# EAGLE design Nanocopter_alt (EAGLE 5.07)
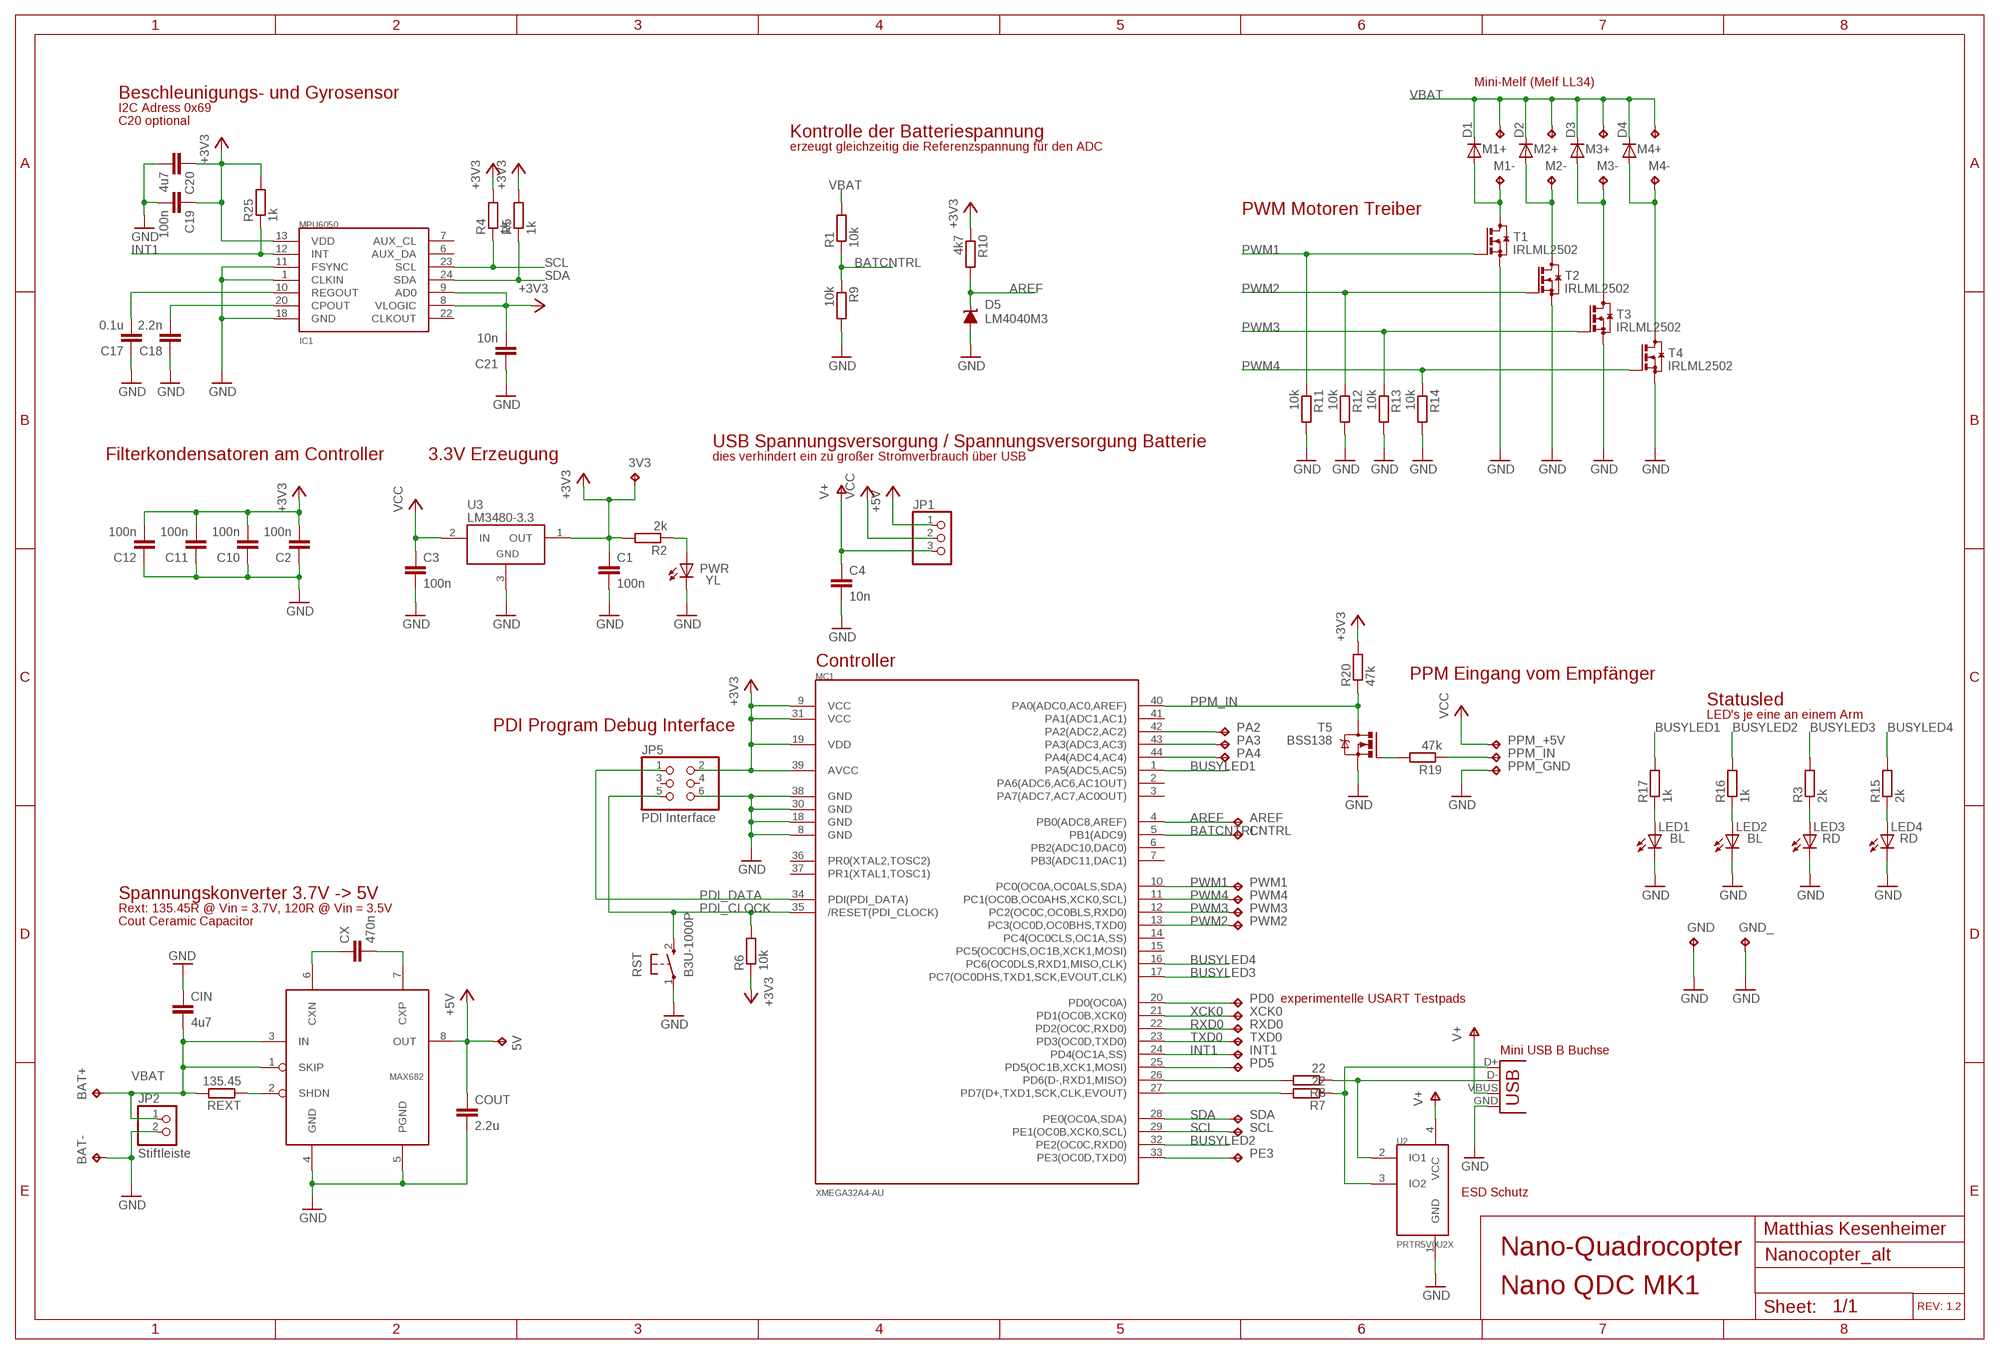
[diagram p0: schematic, sheet 1]

## Parts
3V3  TPTP12SQ  [TP12SQ]
5V  TPTP12SQ  [TP12SQ]
AREF  TPTP10SQ  [TP10SQ]
BAT+  TPTP12SQ  [TP12SQ]
BAT-  TPTP12SQ  [TP12SQ]
C1  100n  C-EUC0603  [C0603]
C2  100n  C-EUC0603  [C0603]
C3  100n  C-EUC0603  [C0603]
C4  10n  C-EUC0603  [C0603]
C10  100n  C-EUC0603  [C0603]
C11  100n  C-EUC0603  [C0603]
C12  100n  C-EUC0603  [C0603]
C17  0.1u  C-EUC0603  [C0603]
C18  2.2n  C-EUC0603  [C0603]
C19  100n  C-EUC0603  [C0603]
C20  4u7  C-EUC0603  [C0603]
C21  10n  C-EUC0603  [C0603]
CIN  4u7  C-EUC1206  [C1206]
CNTRL  TPTP10SQ  [TP10SQ]
COUT  2.2u  C-EUC1206  [C1206]
CX  470n  C-EUC0603  [C0603]
D1  DIODE-MINIMELF  [MINIMELF]
D2  DIODE-MINIMELF  [MINIMELF]
D3  DIODE-MINIMELF  [MINIMELF]
D4  DIODE-MINIMELF  [MINIMELF]
D5  LM4040M3  [SOT-23]
GND  TPTP12SQ  [TP12SQ]
GND_  TPTP12SQ  [TP12SQ]
IC1  MPU6050  [QFN-24]
INT1  TPTP10SQ  [TP10SQ]
JP1  PINHD-1X3  [1X03]
JP2  Stiftleiste  PINHD-1X2  [1X02]
JP5  PDI Interface  PINHD-2X3  [2X03]
LED1  BL  LEDCHIPLED_0603  [CHIPLED_0603]
LED2  BL  LEDCHIPLED_0603  [CHIPLED_0603]
LED3  RD  LEDCHIPLED_0603  [CHIPLED_0603]
LED4  RD  LEDCHIPLED_0603  [CHIPLED_0603]
M1+  TPTP15SQ  [TP15SQ]
M1-  TPTP15SQ  [TP15SQ]
M2+  TPTP15SQ  [TP15SQ]
M2-  TPTP15SQ  [TP15SQ]
M3+  TPTP15SQ  [TP15SQ]
M3-  TPTP15SQ  [TP15SQ]
M4+  TPTP15SQ  [TP15SQ]
M4-  TPTP15SQ  [TP15SQ]
MC1  XMEGA32A4-AU  [TQFP44]
PA2  TPTP10SQ  [TP10SQ]
PA3  TPTP10SQ  [TP10SQ]
PA4  TPTP10SQ  [TP10SQ]
PD0  TPTP10SQ  [TP10SQ]
PD5  TPTP10SQ  [TP10SQ]
PE3  TPTP10SQ  [TP10SQ]
PPM_+5V  TPTP10SQ  [TP10SQ]
PPM_GND  TPTP10SQ  [TP10SQ]
PPM_IN  TPTP10SQ  [TP10SQ]
PWM1  TPTP10SQ  [TP10SQ]
PWM2  TPTP10SQ  [TP10SQ]
PWM3  TPTP10SQ  [TP10SQ]
PWM4  TPTP10SQ  [TP10SQ]
PWR  YL  LEDCHIPLED_0603  [CHIPLED_0603]
R1  10k  R-EU_R0603  [R0603]
R2  2k  R-EU_R0603  [R0603]
R3  2k  R-EU_R0603  [R0603]
R4  1k  R-EU_R0603  [R0603]
R5  1k  R-EU_R0603  [R0603]
R6  10k  R-EU_R0603  [R0603]
R7  22  R-EU_R0603  [R0603]
R8  22  R-EU_R0603  [R0603]
R9  10k  R-EU_R0603  [R0603]
R10  4k7  R-EU_R0603  [R0603]
R11  10k  R-EU_R0603  [R0603]
R12  10k  R-EU_R0603  [R0603]
R13  10k  R-EU_R0603  [R0603]
R14  10k  R-EU_R0603  [R0603]
R15  2k  R-EU_R0603  [R0603]
R16  1k  R-EU_R0603  [R0603]
R17  1k  R-EU_R0603  [R0603]
R19  47k  R-EU_R0603  [R0603]
R20  47k  R-EU_R0603  [R0603]
R25  1k  R-EU_R0603  [R0603]
REXT  135.45  R-EU_R0603  [R0603]
RST  B3U-1000P  [SW_SMD]
RXD0  TPTP10SQ  [TP10SQ]
SCL  TPTP10SQ  [TP10SQ]
SDA  TPTP10SQ  [TP10SQ]
T1  IRLML2502  BSS123  [SOT23]
T2  IRLML2502  BSS123  [SOT23]
T3  IRLML2502  BSS123  [SOT23]
T4  IRLML2502  BSS123  [SOT23]
T5  BSS138  [SOT23]
TXD0  TPTP10SQ  [TP10SQ]
U1  MAX682  [SOIC(N)8]
U2  PRTR5V0U2X  [SOT143B]
U3  LM3480-3.3  [SOT-23-3]
X1  USBSMD  [USB-MINIB]
XCK0  TPTP10SQ  [TP10SQ]

## Nets
+3V3: 3V3.TP C1.1 C2.2 C10.2 C11.2 C12.2 C19.1 C20.1 C21.2 IC1.8(VLOGIC) IC1.9(AD0) IC1.13(VDD) JP5.2 MC1.9(VCC) MC1.19(VDD) MC1.31(VCC) MC1.39(AVCC) R2.2 R4.2 R5.2 R6.1 R10.1 R20.2 R25.2 U3.1(OUT)
+5V: 5V.TP COUT.1 JP1.1 U1.8(OUT)
AREF: AREF.TP D5.1(C) MC1.4(PB0(ADC8,AREF)) R10.2
BATCNTRL: CNTRL.TP MC1.5(PB1(ADC9)) R1.1 R9.1
BUSYLED1: MC1.1(PA5(ADC5,AC5)) R17.2
BUSYLED2: MC1.32(PE2(OC0C,RXD0)) R16.2
BUSYLED3: MC1.17(PC7(OC0DHS,TXD1,SCK,EVOUT,CLK)) R3.2
BUSYLED4: MC1.16(PC6(OC0DLS,RXD1,MISO,CLK)) R15.2
D+: MC1.27(PD7(D+,TXD1,SCK,CLK,EVOUT)) R7.2
D-: MC1.26(PD6(D-,RXD1,MISO)) R8.2
GND: BAT-.TP C1.2 C2.1 C3.2 C4.2 C10.1 C11.1 C12.1 C17.1 C18.1 C19.2 C20.2 C21.1 CIN.1 COUT.2 D5.2(A) GND.TP GND_.TP IC1.1(CLKIN) IC1.11(FSYNC) IC1.18(GND) JP2.2 JP5.6 LED1.C LED2.C LED3.C LED4.C MC1.8(GND) MC1.18(GND) MC1.30(GND) MC1.38(GND) PPM_GND.TP PWR.C R9.2 R11.2 R12.2 R13.2 R14.2 RST.1 T1.2(S) T2.2(S) T3.2(S) T4.2(S) T5.2(S) U1.4(GND) U1.5(PGND) U2.1(GND) U3.3(GND) X1.GND
INT1: IC1.12(INT) INT1.TP MC1.24(PD4(OC1A,SS)) R25.1
N$2: R19.2 T5.1(G)
N$3: PPM_IN.TP R19.1
N$4: MC1.44(PA4(ADC4,AC4)) PA4.TP
N$6: CX.1 U1.6(CXN)
N$7: MC1.43(PA3(ADC3,AC3)) PA3.TP
N$8: MC1.42(PA2(ADC2,AC2)) PA2.TP
N$9: PWR.A R2.1
N$10: LED3.A R3.1
N$11: REXT.1 U1.2(SHDN)
N$13: CX.2 U1.7(CXP)
N$15: LED4.A R15.1
N$17: LED2.A R16.1
N$18: LED1.A R17.1
N$19: D1.A M1-.TP T1.3(D)
N$21: D3.A M3-.TP T3.3(D)
N$22: D4.A M4-.TP T4.3(D)
N$26: C17.2 IC1.10(REGOUT)
N$27: C18.2 IC1.20(CPOUT)
N$30: D2.A M2-.TP T2.3(D)
N$35: MC1.20(PD0(OC0A)) PD0.TP
N$36: MC1.25(PD5(OC1B,XCK1,MOSI)) PD5.TP
N$38: MC1.33(PE3(OC0D,TXD0)) PE3.TP
PDI_CLOCK: JP5.5 MC1.35(/RESET(PDI_CLOCK)) R6.2 RST.2
PDI_DATA: JP5.1 MC1.34(PDI(PDI_DATA))
PPM_IN: MC1.40(PA0(ADC0,AC0,AREF)) R20.1 T5.3(D)
PWM1: MC1.10(PC0(OC0A,OC0ALS,SDA)) PWM1.TP R11.1 T1.1(G)
PWM2: MC1.13(PC3(OC0D,OC0BHS,TXD0)) PWM2.TP R12.1 T2.1(G)
PWM3: MC1.12(PC2(OC0C,OC0BLS,RXD0)) PWM3.TP R13.1 T3.1(G)
PWM4: MC1.11(PC1(OC0B,OC0AHS,XCK0,SCL)) PWM4.TP R14.1 T4.1(G)
RXD0: MC1.22(PD2(OC0C,RXD0)) RXD0.TP
SCL: IC1.23(SCL) MC1.29(PE1(OC0B,XCK0,SCL)) R4.1 SCL.TP
SDA: IC1.24(SDA) MC1.28(PE0(OC0A,SDA)) R5.1 SDA.TP
TXD0: MC1.23(PD3(OC0D,TXD0)) TXD0.TP
USB+: R7.1 U2.3(IO2) X1.D+
USB-: R8.1 U2.2(IO1) X1.D-
V+: C4.1 JP1.3 U2.4(VCC) X1.VBUS
VBAT: BAT+.TP CIN.2 D1.C D2.C D3.C D4.C JP2.1 M1+.TP M2+.TP M3+.TP M4+.TP R1.2 REXT.2 U1.1(SKIP) U1.3(IN)
VCC: C3.1 JP1.2 PPM_+5V.TP U3.2(IN)
XCK0: MC1.21(PD1(OC0B,XCK0)) XCK0.TP
Unconnected: IC1.6(AUX_DA) IC1.7(AUX_CL) IC1.22(CLKOUT) JP5.3 JP5.4 MC1.2(PA6(ADC6,AC6,AC1OUT)) MC1.3(PA7(ADC7,AC7,AC0OUT)) MC1.6(PB2(ADC10,DAC0)) MC1.7(PB3(ADC11,DAC1)) MC1.14(PC4(OC0CLS,OC1A,SS)) MC1.15(PC5(OC0CHS,OC1B,XCK1,MOSI)) MC1.36(PR0(XTAL2,TOSC2)) MC1.37(PR1(XTAL1,TOSC1)) MC1.41(PA1(ADC1,AC1))

## Notes on the sheet
- Mini-Melf (Melf LL34)
- Beschleunigungs- und Gyrosensor
- I2C Adress 0x69
- C20 optional
- Kontrolle der Batteriespannung
- erzeugt gleichzeitig die Referenzspannung für den ADC
- PWM Motoren Treiber
- USB Spannungsversorgung / Spannungsversorgung Batterie
- Filterkondensatoren am Controller | 3.3V Erzeugung | dies verhindert ein zu großer Stromverbrauch über USB
- Controller
- PPM Eingang vom Empfänger
- Statusled
- LED's je eine an einem Arm
- PDI Program Debug Interface
- Spannungskonverter 3.7V -> 5V
- Rext: 135.45R @ Vin = 3.7V, 120R @ Vin = 3.5V
- Cout Ceramic Capacitor
- experimentelle USART Testpads
- Mini USB B Buchse
- ESD Schutz
- Matthias Kesenheimer
- Nano-Quadrocopter
- Nano QDC MK1
- REV: 1.2

## Library data of the parts
3V3 5V AREF BAT+ BAT- CNTRL GND GND_ INT1 M1+ M1- M2+ M2- M3+ M3- M4+ M4- PA2-PA4 PD0 PD5 PE3 PPM_+5V PPM_GND PPM_IN PWM1-PWM4 RXD0 SCL SDA TXD0 XCK0 = testpad:TP: Test pad
C1-C4 C10-C12 C17-C21 CIN COUT CX = rcl:C-EU: CAPACITOR, European symbol
D1-D4 = diode:DIODE-: DIODE
D5 = texas:LM4040M3
IC1 = SparkFun:MPU6050
JP1 = pinhead:PINHD-1X3: PIN HEADER
JP2 = pinhead:PINHD-1X2: PIN HEADER
JP5 = pinhead:PINHD-2X3: PIN HEADER
LED1-LED4 PWR = led:LED: LED OSRAM: - CHIPLED LG R971, LG N971, LY N971, LG Q971, LY Q971, LO R971, LY R971 LH N974, LH R974 LS Q976, LO Q976, LY Q976 LO Q996 - Hyper CHIPLED LW Q18S LB Q993, LB Q99A, LB R99A - SideLED LS A670, LO A670, LY A670, LG A670, LP A670 LB A673, LV A673, LT A673, LW A673 LH A674 LY A675 LS A676, LA A676, LO A676, LY A676, LW A676 LS A679, LY A679, LG A679 - Hyper Micro SIDELED® LS Y876, LA Y876, LO Y876, LY Y876 LT Y87S - SmartLED LW L88C, LW L88S LB L89C, LB L89S, LG L890 LS L89K, LO L89K, LY L89K LS L896, LA L896, LO L896, LY L896 - TOPLED LS T670, LO T670, LY T670, LG T670, LP T670 LSG T670, LSP T670, LSY T670, LOP T670, LYG T670 LG T671, LOG T671, LSG T671 LB T673, LV T673, LT T673, LW T673 LH T674 LS T676, LA T676, LO T676, LY T676, LB T676, LH T676, LSB T676, LW T676 LB T67C, LV T67C, LT T67C, LS T67K, LO T67K, LY T67K, LW E67C LS E67B, LA E67B, LO E67B, LY E67B, LB E67C, LV E67C, LT E67C LW T67C LS T679, LY T679, LG T679 LS T770, LO T770, LY T770, LG T770, LP T770 LB T773, LV T773, LT T773, LW T773 LH T774 LS E675, LA E675, LY E675, LS T675 LS T776, LA T776, LO T776, LY T776, LB T776 LHGB T686 LT T68C, LB T68C - Hyper Mini TOPLED® LB M676 - Mini TOPLED Santana® LG M470 LS M47K, LO M47K, LY M47K Source: http://www.osram.convergy.de LUXEON: - LUMILED® LXK2-PW12-R00, LXK2-PW12-S00, LXK2-PW14-U00, LXK2-PW14-V00 LXK2-PM12-R00, LXK2-PM12-S00, LXK2-PM14-U00 LXK2-PE12-Q00, LXK2-PE12-R00, LXK2-PE12-S00, LXK2-PE14-T00, LXK2-PE14-U00 LXK2-PB12-K00, LXK2-PB12-L00, LXK2-PB12-M00, LXK2-PB14-N00, LXK2-PB14-P00, LXK2-PB14-Q00 LXK2-PR12-L00, LXK2-PR12-M00, LXK2-PR14-Q00, LXK2-PR14-R00 LXK2-PD12-Q00, LXK2-PD12-R00, LXK2-PD12-S00 LXK2-PH12-R00, LXK2-PH12-S00 LXK2-PL12-P00, LXK2-PL12-Q00, LXK2-PL12-R00 Source: www.luxeon.com KINGBRIGHT: KA-3528ASYC Source: www.kingbright.com
MC1 = atmel:XMEGA32A4-AU
R1-R17 R19 R20 R25 REXT = rcl:R-EU_: RESISTOR, European symbol
RST = Omron:B3U-1000P
T1-T4 = transistor-small-signal:BSS123: N-CHANNEL MOS FET
T5 = mylib:BSS138
U1 = maxim:MAX682
U2 = Philips:PRTR5V0U2X
U3 = regulators:LM3480-*: National Semiconductor LM3480 100 mA, SOT-23, quasi-LDO linear regulator
X1 = SparkFun:USB: USB Connectors USB-B-PTH is fully proven SKU : PRT-00139 USB-miniB is fully proven SKU : PRT-00587 USB-A-PCB is untested. USB-A-H is throughly reviewed, but untested. Spark Fun Electronics SKU : PRT-00437 USB-B-SMT is throughly reviewed, but untested. Needs silkscreen touching up. USB-A-S has not been used/tested USB-MB-H has not been used/tested

## Board
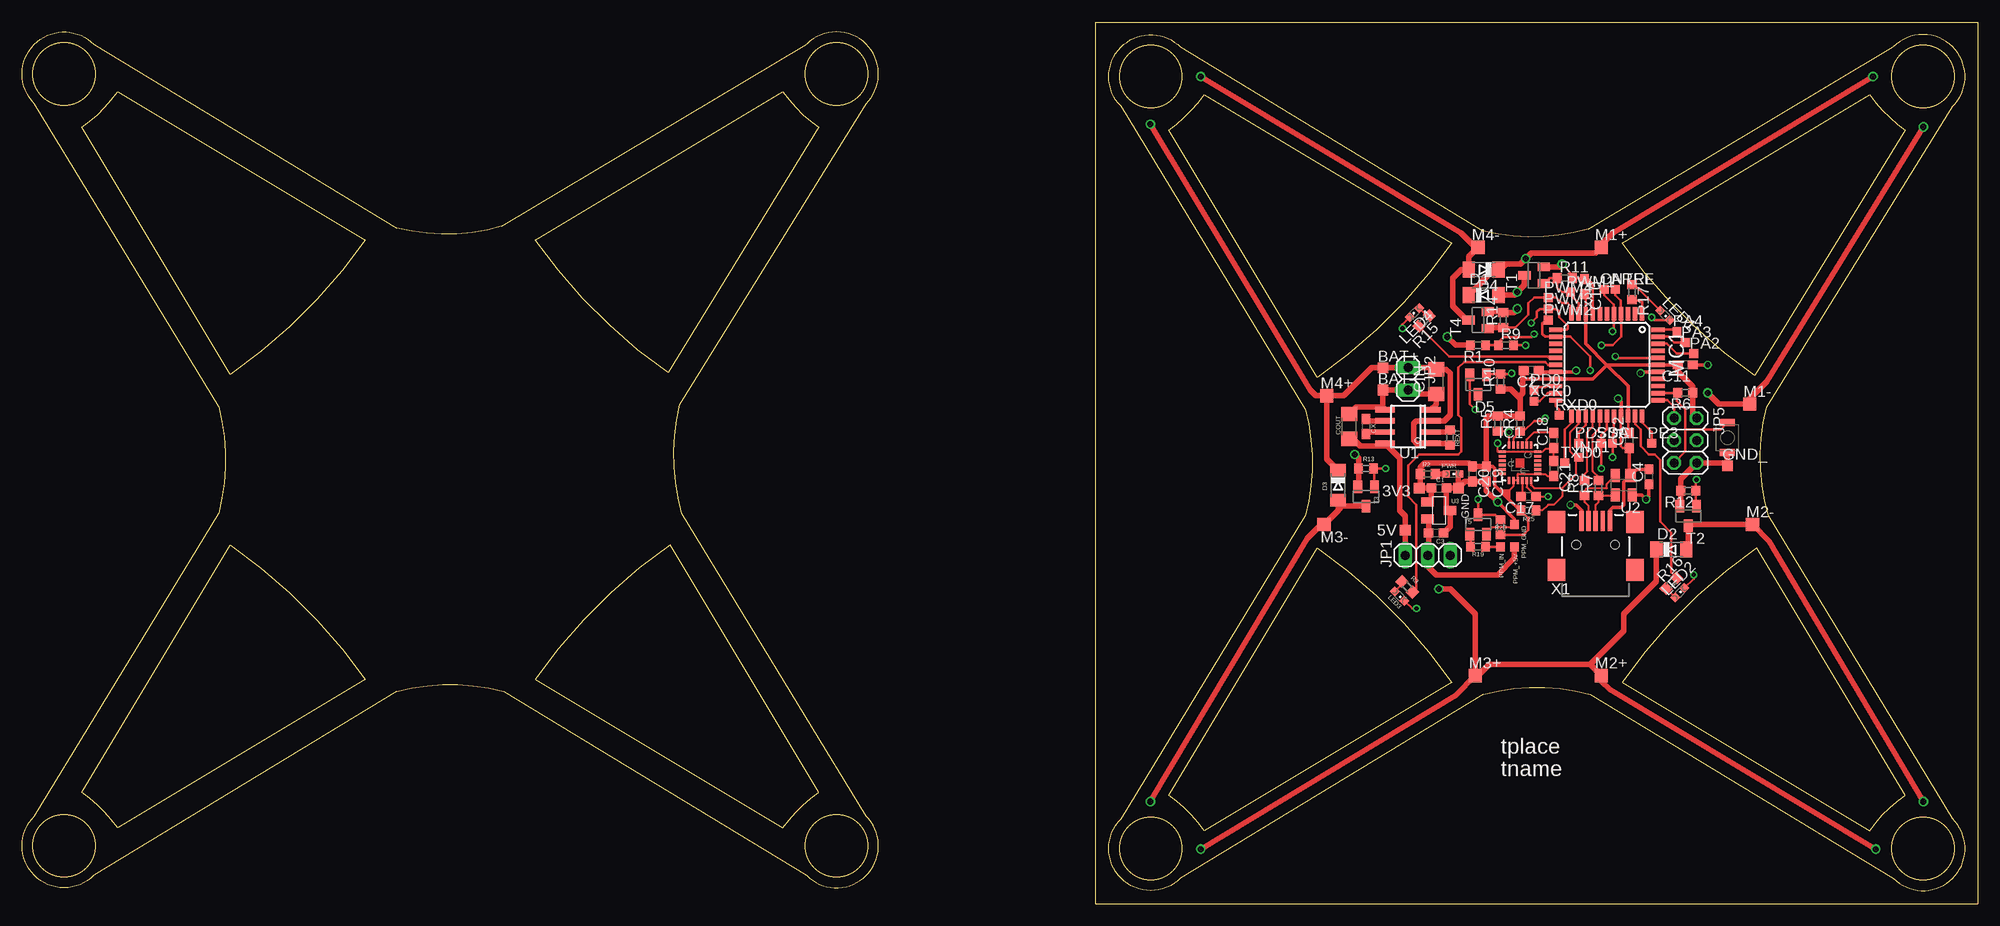
[diagram p1: board, top side]
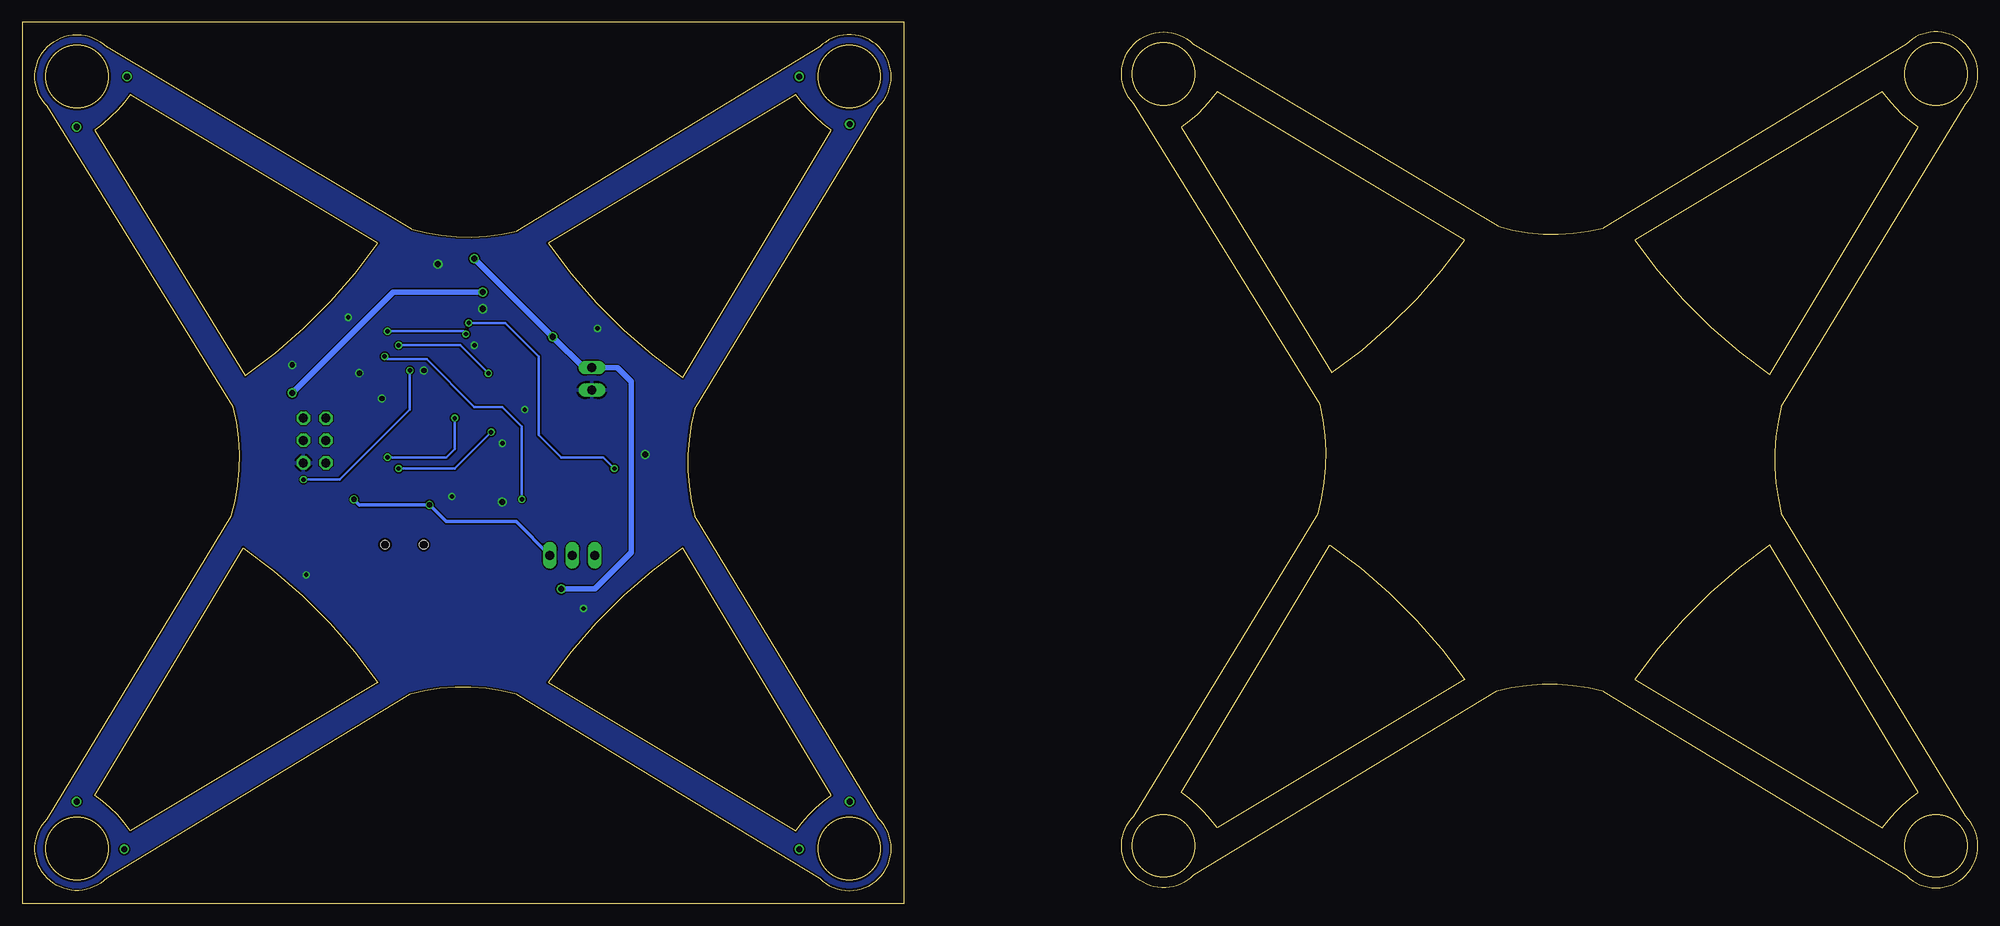
[diagram p2: board, bottom side, seen from below]

Size 221.73 x 100 mm. Coordinates in mm from the lower left corner, seen from the top.
Outline: 165.67,23.76 arc-30 177.79,23.76 212.14,2.88 arc90 218.88,2.88 arc90 218.88,9.61 198,43.96 arc-30 197.77,56.31 218.88,90.44 arc90 218.88,97.17 arc90 212.14,97.17 177.57,76.52 arc-30 165.67,76.29 131.32,97.17 arc90 124.59,97.17 arc90 124.59,90.44 145.46,56.09 arc-30 145.46,43.96 124.59,9.61 arc90 124.59,2.88 arc90 131.32,2.88 165.67,23.76
Outline: 209.45,8.27 arc-20 213.49,12.31 196.65,40.37 arc20 181.39,25.11 209.45,8.27
Outline: 196.43,59.9 arc-20 181.39,74.95 209.45,91.78 arc20 213.49,87.74 196.43,59.9
Outline: 162.08,74.95 arc-20 146.81,59.68 129.97,87.74 arc20 134.01,91.78 162.08,74.95
Outline: 146.81,40.37 arc-20 162.08,25.11 134.01,8.27 arc20 129.97,12.31 146.81,40.37
Outline: 121.73,0 121.73,100 221.73,100 221.73,0 121.73,0
Outline: 42.48,24.08 arc-30 54.6,24.08 88.95,3.2 arc90 95.69,3.2 arc90 95.69,9.93 74.81,44.28 arc-30 74.58,56.63 95.69,90.75 arc90 95.69,97.49 arc90 88.95,97.49 54.38,76.84 arc-30 42.48,76.61 8.13,97.49 arc90 1.39,97.49 arc90 1.39,90.75 22.27,56.41 arc-30 22.27,44.28 1.39,9.93 arc90 1.39,3.2 arc90 8.13,3.2 42.48,24.08
Outline: 86.26,8.59 arc-20 90.3,12.63 73.46,40.69 arc20 58.2,25.42 86.26,8.59
Outline: 73.24,60.22 arc-20 58.2,75.26 86.26,92.1 arc20 90.3,88.06 73.24,60.22
Outline: 38.89,75.26 arc-20 23.62,60 6.78,88.06 arc20 10.82,92.1 38.89,75.26
Outline: 23.62,40.69 arc-20 38.89,25.42 10.82,8.59 arc20 6.78,12.63 23.62,40.69
Outline: circle at 215.51,93.81 radius 3.55
Outline: circle at 215.51,6.25 radius 3.55
Outline: circle at 127.95,93.81 radius 3.55
Outline: circle at 127.95,6.25 radius 3.55
Outline: circle at 92.32,94.12 radius 3.55
Outline: circle at 92.32,6.57 radius 3.55
Outline: circle at 4.76,94.12 radius 3.55
Outline: circle at 4.76,6.57 radius 3.55
Copper layers (1*16): Top 0.035mm / dielectric 1.5mm / Bottom 0.035mm
Design rules: minimum track width 6mil, minimum drill 12mil, track to track 6mil, track to pad 6mil, pad to pad 6mil, via to via 6mil, smd to smd 0mil, copper to edge 10mil, drill to drill 10mil, minimum pad ring 10mil, minimum via ring 6mil, stop-mask expansion 2mil, vias tented up to drill 100mil, thermal gap 10mil

### Footprints (pad centres in the part's own frame; a part is rotated, then mirrored left to right if it is on the bottom)
TP12SQ = smd 1.2 x 1.2: TP 0,0
TP10SQ = smd 1 x 1: TP 0,0
C0603 = smd 1.1 x 1: 1 -0.85,0; 2 0.85,0
C1206 = smd 1.6 x 1.8: 1 -1.4,0; 2 1.4,0
MINIMELF = smd 1.4 x 1.8: A 1.7,0; C -1.7,0
SOT-23 = smd 1 x 1.4: 1 -0.95,-1.1; 2 0.95,-1.1; 3 0,1.1
QFN-24 = smd 0.8 x 0.3: 1 -2,1.25; 2 -2,0.75; 3 -2,0.25; 4 -2,-0.25; 5 -2,-0.75; 6 -2,-1.25; 13 2,-1.25; 14 2,-0.75; 15 2,-0.25; 16 2,0.25; 17 2,0.75; 18 2,1.25 | smd 0.3 x 0.8: 7 -1.25,-2; 8 -0.75,-2; 9 -0.25,-2; 10 0.25,-2; 11 0.75,-2; 12 1.25,-2; 19 1.25,2; 20 0.75,2; 21 0.25,2; 22 -0.25,2; 23 -0.75,2; 24 -1.25,2
1X03 = drill 1.016 long: 1 -2.54,0; 2 0,0; 3 2.54,0
1X02 = drill 1.016 long: 1 -1.27,0; 2 1.27,0
2X03 = drill 1.016 octagon: 1 -2.54,-1.27; 2 -2.54,1.27; 3 0,-1.27; 4 0,1.27; 5 2.54,-1.27; 6 2.54,1.27
CHIPLED_0603 = smd 0.8 x 0.8: A 0,-0.75; C 0,0.75
TP15SQ = smd 1.5 x 1.5: TP 0,0
TQFP44 = smd 1.5 x 0.5: 1 -5.8,4; 2 -5.8,3.2; 3 -5.8,2.4; 4 -5.8,1.6; 5 -5.8,0.8; 6 -5.8,0; 7 -5.8,-0.8; 8 -5.8,-1.6; 9 -5.8,-2.4; 10 -5.8,-3.2; 11 -5.8,-4; 23 5.8,-4; 24 5.8,-3.2; 25 5.8,-2.4; 26 5.8,-1.6; 27 5.8,-0.8; 28 5.8,0; 29 5.8,0.8; 30 5.8,1.6; 31 5.8,2.4; 32 5.8,3.2; 33 5.8,4 | smd 0.5 x 1.5: 12 -4,-5.8; 13 -3.2,-5.8; 14 -2.4,-5.8; 15 -1.6,-5.8; 16 -0.8,-5.8; 17 0,-5.8; 18 0.8,-5.8; 19 1.6,-5.8; 20 2.4,-5.8; 21 3.2,-5.8; 22 4,-5.8; 34 4,5.8; 35 3.2,5.8; 36 2.4,5.8; 37 1.6,5.8; 38 0.8,5.8; 39 0,5.8; 40 -0.8,5.8; 41 -1.6,5.8; 42 -2.4,5.8; 43 -3.2,5.8; 44 -4,5.8
R0603 = smd 1 x 1.1: 1 -0.85,0; 2 0.85,0
SW_SMD = smd 0.8 x 1.7: 1 -1.7,0; 2 1.7,0
SOT23 = smd 1 x 1.4: 1 -0.95,-1.1; 2 0.95,-1.1; 3 0,1.1
SOIC(N)8 = smd 2.2 x 0.6: 1 -2.6,1.905; 2 -2.6,0.635; 3 -2.6,-0.635; 4 -2.6,-1.905; 5 2.6,-1.905; 6 2.6,-0.635; 7 2.6,0.635; 8 2.6,1.905
SOT143B = smd 1.2 x 1.44: 1 -0.75,-1.1 | smd 1 x 1.44: 2 0.95,-1.1; 3 0.95,1.1; 4 -0.95,1.1
SOT-23-3 = smd 1.016 x 1.397: 1 -0.953,-1.27; 2 0.953,-1.27; 3 0,1.27
USB-MINIB = smd 2.25 x 0.5: D+ 2.625,0; D- 2.625,0.8; GND 2.625,-1.6; ID 2.625,-0.8; VBUS 2.625,1.6 | smd 2.5 x 2: MTN1 -2.95,4.45; MTN2 2.5,4.45; MTN3 -2.95,-4.45; MTN4 2.5,-4.45 | hole 1: -0.07,2.2; -0.07,-2.2

### Placement (x,y rotation side)
3V3  158.39,47.14 90 top
5V  156.8,42.38 90 top
AREF  180.62,69.68 0 top
BAT+  154.26,60.79 0 top
BAT-  154.26,58.25 0 top
C1  160.61,47.14 0 top
C2  171.09,60.48 180 top
C3  160.3,42.06 0 top
C4  184.43,48.41 90 top
C10  177.12,70 270 top
C11  188.55,61.11 180 top
C12  182.2,52.54 90 top
C17  170.77,46.19 180 top
C18  173.63,52.54 90 top
C19  166.01,48.73 270 top
C20  164.42,48.73 270 top
C21  173.63,49.36 270 top
CIN  160.3,59.21 90 top
CNTRL  179.35,69.68 0 top
COUT  150.45,54.13 90 top
CX  152.36,54.13 270 top
D1  165.69,69.05 0 top
D2  186.97,40.16 0 top
D3  149.18,47.46 270 top
D4  165.69,71.91 180 top
D5  165.06,58.89 180 top
GND  162.84,47.14 90 top
GND_  193.32,49.68 0 top
IC1  169.82,50 0 top
INT1  176.49,50.63 0 top
JP1  159.34,39.52 0 top
JP2  157.12,59.52 270 top
JP5  188.55,52.54 270 top
LED1  186.24,66.73 225 top
LED2  187.92,35.26 315 top
LED3  156.17,34.89 225 top
LED4  157.85,67.05 135 top
M1+  179.03,74.45 0 top
M1-  195.86,56.67 0 top
M2+  179.03,25.87 0 top
M2-  196.17,43.01 0 top
M3+  164.74,25.87 0 top
M3-  147.6,43.01 0 top
M4+  147.91,57.62 0 top
M4-  165.06,74.45 0 top
MC1  179.66,61.11 270 top
PA2  189.51,62.38 0 top
PA3  188.55,63.65 0 top
PA4  187.6,64.92 0 top
PD0  171.41,58.25 0 top
PD5  176.49,52.22 0 top
PE3  184.74,52.22 0 top
PPM_+5V  169.19,40.47 90 top
PPM_GND  169.19,43.01 0 top
PPM_IN  167.6,40.47 0 top
PWM1  175.54,69.37 0 top
PWM2  173,66.19 0 top
PWM3  173,67.46 0 top
PWM4  173,68.73 0 top
PWR  162.2,48.73 270 top
R1  165.06,63.33 180 top
R2  159.34,48.73 180 top
R3  157.03,35.94 315 top
R4  169.82,54.44 90 top
R5  167.28,54.44 90 top
R6  188.55,57.94 180 top
R7  178.71,47.14 90 top
R8  177.12,47.14 90 top
R9  168.23,63.33 0 top
R10  167.6,59.21 90 top
R11  174.9,70.95 0 top
R12  188.87,46.82 180 top
R13  152.36,49.36 180 top
R14  167.92,66.19 90 top
R15  158.93,66.1 225 top
R16  186.97,36.35 45 top
R17  182.52,69.37 270 top
R19  165.06,40.47 180 top
R20  167.6,42.7 270 top
R25  170.77,44.6 180 top
REXT  161.88,52.86 270 top
RST  193.32,52.86 90 top
RXD0  174.27,55.4 0 top
SCL  180.3,52.22 0 top
SDA  179.03,52.22 0 top
T1  171.41,71.27 90 top
T2  188.87,43.97 180 top
T3  152.36,46.19 180 top
T4  165.06,66.19 90 top
T5  165.06,43.01 0 top
TXD0  174.9,50 0 top
U1  157.12,54.13 180 top
U2  181.57,47.46 180 top
U3  160.61,44.6 270 top
X1  178.39,40.79 90 top
XCK0  171.41,56.98 0 top

### Tracks (layer width: path | path; a pad name or v marks a point on that pad's centre or on a via)
+3V3
  Top 0.254: C21.2 172.89,48.51 172.68,48.73 171.84,48.73 IC1.13 169.57,48.75 IC1.9 IC1.8 169.07,47.34 168.55,46.82 | 169.82,44.6 R25.2
  Top 0.305: MC1.31 182.07,53.53 C12.2 | MC1.9 177.26,69.01 C10.2 | R20.2 170.24,41.85 170.77,42.38 170.77,43.75 R25.2
  Top 0.406: MC1.9 177.26,63.51 179.67,61.11 | 179.67,61.11 MC1.39 C11.2 | MC1.31 182.07,58.71 179.67,61.11 | C19.1 166.75,49.58 166.96,49.36 166.96,47.46 167.6,46.82 | 167.6,46.82 168.55,46.82 168.55,46.19 | 168.55,45.87 169.82,44.6 | 167.6,46.82 168.55,45.87 | 168.55,46.19 168.55,45.87 | 179.67,61.11 178.07,59.51 MC1.19 170.15,59.51 170.14,59.52 | 168.55,46.19 168.23,46.51 | 170.14,60.37 C2.2
  Top 0.61: C11.2 187.7,60.37 189.4,58.67 R6.1 189.4,55.5 JP5.2 | 169.82,57.3 R4.2 R5.2 166.23,55.29 166.01,55.08 C19.1 C20.1 164,50 159.03,50 158.5,49.47 R2.2 158.5,47.24 3V3.TP C1.1 159.76,45.97 U3.1 | 169.82,57.3 169.82,57.62 170.14,57.94 170.14,58.89 | 170.14,58.89 170.14,59.52 170.14,60.37 | C2.2 170.14,60.58 | 170.14,58.89 170.04,58.99 | R10.1 168.77,58.36 169.82,57.3
+5V
  Top 0.406: COUT.1 150.14,52.41
  Top 0.61: JP1.1 5V.TP 156.81,43.97 156.17,44.6 156.17,50.57 154.84,51.9 154.2,51.9 | COUT.1 150.9,52.73 151.72,51.9 153.95,51.9 154.2,51.9 | U1.8 154.2,51.9
AREF  (via drill 0.5)
  Top 0.305: v179.03,63.33 180.3,63.33 181.26,64.3 MC1.4 181.25,66.92 181.25,68.41 180.62,69.05 AREF.TP | D5.1 166.08,60.06 R10.2 168.77,60.06 v168.87,60.16
  Bottom 0.305: v179.03,63.33 172.05,63.33 v168.87,60.16
BATCNTRL  (via drill 0.5)
  Top 0.305: v180.3,64.92 180.47,65.09 MC1.5 180.47,67.93 179.35,69.05 CNTRL.TP | R1.1 R9.1 167.38,63.75 167.92,64.29 171.09,64.29 v171.41,64.6
  Bottom 0.305: v180.3,64.92 171.73,64.92 v171.41,64.6
BUSYLED1
  Top 0.305: MC1.1 183.67,68.22 183.48,68.41 182.63,68.41 R17.2
BUSYLED2
  Top 0.305: MC1.32 182.86,54.42 183.48,53.81 183.48,51.9 184.43,50.95 185.06,50.95 185.7,50.32 185.7,43.33 186.97,42.06 186.97,37.55 R16.2
BUSYLED3
  Top 0.305: MC1.17 173,61.11 172.68,61.43 163.47,61.43 162.84,60.79 162.84,55.4 163.16,55.08 163.16,51.27 162.84,50.95 158.39,50.95 157.12,49.68 157.12,46.19 158.08,45.24 158.08,35.78 R3.2
BUSYLED4
  Top 0.305: MC1.16 173.15,61.91 173,62.06 161.77,62.06 R15.2
D+
  Top 0.254: MC1.27 178.87,53.96 178.08,53.17 178.08,49.05 178.71,48.41 R7.2
D-
  Top 0.254: MC1.26 178.07,54.11 177.44,53.49 177.44,49.05 177.12,48.73 R8.2
GND  (via drill 0.5, 0.6, 0.7)
  Top 0.254: C21.1 C18.1 173.53,51.59 172.68,51.59 172.34,51.25 IC1.18 IC1.1 167.3,51.25 167.28,51.27 v167.28,52.22 | IC1.11 170.57,47.24 C17.1 v173,46.19 | 166.01,42.06 166.65,42.7 168.87,42.7 PPM_GND.TP
  Top 0.305: C12.1 181.47,51.69 181.25,51.9 181.25,55.3 MC1.30 | MC1.8 178.08,66.92 178.08,70.32 177.54,70.85 C10.1 177.02,70.95 R11.2 175.75,71.37 v174.58,72.54 | LED1.C 185.05,66.2 v184.75,66.51 | R12.2 187.92,46.72 | 166.01,42.06 T5.2 | LED4.C 156.49,65.69 v156.49,65.24 | R9.2 v170.46,63.33 | D5.2 164.11,56.66 v164.74,56.03 | LED3.C 157.57,33.49 v158.08,33.49 | LED2.C 189.51,36.85 v189.51,37.3
  Top 0.406: MC1.30 181.26,56.97 v180.93,57.3 | MC1.38 183.63,60.31 v183.48,60.16 | v176.17,60.48 176.01,60.31 MC1.18 172.11,60.31 C2.1 | C11.1 v191.09,61.11 | U2.1 182.2,48.67 C12.1 | X1.GND 180,44.61 180.3,44.92 181.25,44.92 181.57,45.24 181.57,47.81 U2.1 | v167.28,45.55 169.19,43.65 PPM_GND.TP | C4.2 183.02,49.26 U2.1
  Top 0.61: T2.2 188.02,45.17 R12.2 188.02,48.2 JP5.6 193,50 GND_.TP RST.1 | T1.2 174.27,72.22 v174.58,72.54 | v169.5,67.46 169.08,67.04 R14.2 167.82,67.14 T4.2 | v167.28,45.55 166.01,46.82 C19.2 C20.2 163.58,47.88 GND.TP | 154.27,56.35 BAT-.TP JP2.2 157.57,57.81 CIN.1 160.3,56.61 U1.4 | 154.27,56.35 154.27,56.29 U1.5 154.52,56.09 154.27,56.35 | GND.TP C1.2 161.47,45.02 U3.3 161.89,42.8 C3.2 | GND.TP 162.84,48.61 PWR.C | T3.2 151.51,47.39 R13.2 151.51,50.53 v151.09,50.95 | COUT.2 151.28,56.35 154.27,56.35
  pour Bottom: 227.29,-3.34 119.97,-3.34 119.97,108.1 227.29,108.1 227.29,-3.02
INT1
  Top 0.254: 171.09,47.98 IC1.12 171.07,47.48 171.41,47.14 174.58,47.14 | R25.1 172.36,44.6 173,45.24 173.63,45.24 174.58,46.19 174.58,47.14 | MC1.24 176.49,55.29 176.49,54.44 175.54,53.49 175.54,51.27 176.17,50.63 176.17,48.73 174.58,47.14
  Top 0.305: 176.17,50.63 INT1.TP
N$2
  Top 0.305: R19.2 164.21,41.81 T5.1
N$3
  Top 0.305: PPM_IN.TP R19.1
N$4
  Top 0.305: MC1.44 187.41,65.11 PA4.TP
N$6
  Top 0.61: U1.6 152.58,54.76 CX.1
N$7
  Top 0.305: MC1.43 186.63,64.31 187.28,63.65 PA3.TP
N$8
  Top 0.305: MC1.42 186.47,63.51 187.6,62.38 PA2.TP
N$9
  Top 0.61: PWR.A R2.1
N$10
  Top 0.305: R3.1 156.43,36.21 LED3.A
N$11
  Top 0.61: U1.2 161.67,53.49 REXT.1
N$13
  Top 0.61: U1.7 152.58,53.49 CX.2
N$15
  Top 0.305: R15.1 159.26,66.7 LED4.A
N$17
  Top 0.305: R16.1 LED2.A
N$18
  Top 0.305: R17.1 182.76,70.22 LED1.A
N$19  (via drill 0.7)
  Top 0.61: T1.3 170.31,70.17 v169.5,69.37 169.19,69.05 D1.A | v191.09,57.94 192.36,56.67 M1-.TP 195.86,57.3 197.76,59.21 v215.54,88.1
  Bottom 0.61: v169.5,69.37 179.67,69.37 v191.09,57.94
N$21  (via drill 0.7)
  Top 0.61: 149.18,44.6 D3.A | 149.18,44.6 M3-.TP 147.28,43.01 145.69,41.43 v127.91,11.58 | T3.3 149.67,45.09 149.18,44.6
N$22  (via drill 0.7)
  Top 0.61: T4.3 163.79,66.19 162.2,67.78 162.2,70.95 163.16,71.91 D4.A 164,73.38 M4-.TP | M4-.TP 165.06,74.76 | M4-.TP 164.74,74.45 163.16,76.03 v133.63,93.81
N$26
  Top 0.254: IC1.10 170.07,46.34 C17.2
N$27
  Top 0.254: IC1.20 170.57,52.65 171.41,53.49 173.53,53.49 C18.2
N$30  (via drill 0.7)
  Top 0.61: M2-.TP 196.03,42.87 | D2.A 188.87,40.36 T2.3 189.02,43.01 M2-.TP | M2-.TP 198.08,41.11 v215.54,11.58
N$35
  Top 0.305: MC1.20 172.82,58.71 172.68,58.57 171.73,58.57 PD0.TP
N$36
  Top 0.305: MC1.25 177.26,54.27 176.49,53.49 PD5.TP
N$38
  Top 0.305: MC1.33 183.67,54.57 184.75,53.49 PE3.TP
PDI_CLOCK
  Top 0.305: MC1.35 185.49,57.94 R6.2 187.6,57.83 187.6,56.98 188.56,56.03 188.56,53.81 | 188.56,53.81 188.56,51.27 JP5.5 | RST.2 192.57,53.81 188.56,53.81
PDI_DATA
  Top 0.305: MC1.34 186.52,57.11 187.28,56.35 JP5.1
PPM_IN  (via drill 0.5)
  Top 0.305: MC1.40 180.77,61.91 v180.62,62.06 | R20.1 167.03,44.11 T5.3 v165.06,45.87
  Bottom 0.305: v180.62,62.06 180.3,61.75 175.86,61.75 170.46,56.35 167.28,56.35 165.06,54.13 v165.06,45.87
PWM1
  Top 0.305: MC1.10 176.49,66.94 176.49,68.1 175.54,69.05 PWM1.TP 174.58,69.37 174.05,69.9 R11.1 | R11.1 174.27,70.95 | R11.1 173.14,70.95 T1.1
PWM2  (via drill 0.5)
  Top 0.305: v189.83,48.09 189.72,47.99 R12.1 189.72,45.17 T2.1 | PWM2.TP 172.68,66.19 172.36,65.87 172.36,64.6 172.65,64.31 MC1.13 175.51,64.31 177.76,62.06 v177.76,60.48
  Bottom 0.305: v189.83,48.09 185.7,48.09 177.76,56.03 v177.76,60.48
PWM3  (via drill 0.5)
  Top 0.305: MC1.12 175.09,65.11 175.22,65.24 175.22,65.56 174.27,66.51 174.27,67.14 173.95,67.46 PWM3.TP 172.05,67.46 171.73,67.14 171.73,66.51 v171.09,65.87 | v154.58,49.36 R13.1 153.31,49.26 T3.1
  Bottom 0.305: v171.09,65.87 166.96,65.87 163.16,62.06 163.16,53.17 160.61,50.63 155.85,50.63 v154.58,49.36
PWM4
  Top 0.305: MC1.11 175.67,67.65 175.22,68.1 174.58,68.1 173.95,68.73 PWM4.TP 171.41,68.73 170.77,68.1 170.77,66.83 169.29,65.34 R14.1
  Top 0.61: R14.1 166.26,65.34 T4.1
RXD0
  Top 0.305: MC1.22 173.87,56.43 174.27,56.03 RXD0.TP
SCL  (via drill 0.5)
  Top 0.254: R4.1 169.82,53.49 169.07,52.74 IC1.23
  Top 0.305: MC1.29 180.47,53.34 180.3,53.17 SCL.TP | SCL.TP 180.47,52.39 | v180.3,50.63 SCL.TP | v172.68,55.08 172.36,54.76 171.41,54.76 170.24,53.59 R4.1
  Bottom 0.305: v180.3,50.63 173.63,50.63 172.68,51.59 v172.68,55.08
SDA  (via drill 0.5)
  Top 0.254: R5.1 168.45,53.59 v168.55,53.49 168.55,52.02 IC1.24
  Top 0.305: MC1.28 179.67,53.81 179.03,53.17 SDA.TP v179.03,49.36
  Bottom 0.305: v168.55,53.49 172.68,49.36 v179.03,49.36
TXD0
  Top 0.305: MC1.23 175.67,54.57 174.9,53.81 TXD0.TP
USB+
  Top 0.254: U2.3 180.55,46.29 R7.1 178.71,45.55 178.4,45.24 X1.D+
USB-
  Top 0.254: U2.2 179.67,47.6 179.67,47.14 177.44,47.14 177.12,46.82 R8.1 177.12,45.55 177.59,45.08 X1.D-
V+  (via drill 0.6)
  Top 0.406: U2.4 183.62,46.36 v184.11,45.87 184.43,46.19 C4.1 | v175.54,45.24 176.17,45.24 176.79,44.61 X1.VBUS
  Bottom 0.406: v184.11,45.87 183.48,45.24 v175.54,45.24 173.63,43.33 165.7,43.33 JP1.3
VBAT  (via drill 0.7)
  Top 0.305: D1.C 164.11,68.94
  Top 0.61: M1+.TP 178.71,74.13 | D1.C 166.85,71.91 D4.C 167.6,71.91 168.23,72.54 169.82,72.54 v170.46,73.18 171.09,73.81 178.4,73.81 M1+.TP | R1.2 162.52,63.33 v161.57,64.29 | M4+.TP 149.82,57.62 152.99,60.79 BAT+.TP JP2.1 160.11,60.79 CIN.2 161.44,60.61 161.89,60.16 161.89,55.4 161.25,54.76 U1.3 158.08,54.76 157.76,54.44 157.76,52.54 158.08,52.22 U1.1 161.67,52.22 REXT.2 | M4+.TP 147.92,50.43 D3.C | M3+.TP 164.74,32.85 161.89,35.71 v160.61,35.71 | M3+.TP 165.06,25.87 166.33,27.14 177.76,27.14 | 177.76,27.14 M2+.TP 179.03,25.23 179.98,24.28 v210.14,6.18 | D2.C 185.27,36.55 181.57,32.85 181.57,30.95 177.76,27.14 | M1+.TP 179.03,74.76 180.3,76.03 v209.83,93.81 | M4+.TP 146.65,57.62 146.01,58.25 v127.91,88.42 | M3+.TP 162.52,23.65 v133.63,6.18
  Bottom 0.61: v170.46,73.18 v161.57,64.29 158.08,60.79 JP2.1 BAT+.TP 152.68,59.21 152.68,39.84 156.81,35.71 v160.61,35.71
VCC
  Top 0.61: U3.2 159.45,43.55 C3.1 159.45,39.62 | 159.45,39.62 JP1.2 | 159.45,39.62 159.45,38.15 160.3,37.3 167.28,37.3 169.19,39.2 PPM_+5V.TP
XCK0
  Top 0.305: MC1.21 172.97,57.91 172.05,56.98 XCK0.TP

### Text on the board
tPlace: tplace
tNames: tname